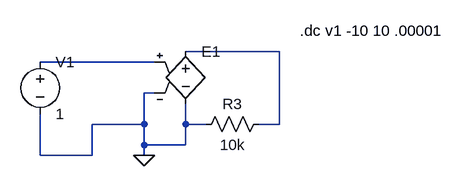
[diagram p0: schematic e_table.asc]
e_table.asc, the LTspice schematic file:
Version 4
SHEET 1 880 680
WIRE 320 112 176 112
WIRE 128 128 -48 128
WIRE 128 176 112 176
WIRE 112 224 112 176
WIRE 112 224 32 224
WIRE 176 224 176 192
WIRE 208 224 176 224
WIRE 320 224 320 112
WIRE 320 224 288 224
WIRE 112 256 112 224
WIRE 176 256 176 224
WIRE 176 256 112 256
WIRE -48 272 -48 208
WIRE 32 272 32 224
WIRE 32 272 -48 272
WIRE 112 272 112 256
FLAG 112 272 0
SYMBOL e 176 96 R0
WINDOW 3 24 96 Invisible 2
SYMATTR Value (-100,-12)(-.6u,-12)(.6u,12)(100,12)
SYMATTR InstName E1
SYMATTR SpiceModel table
SYMBOL res 304 208 R90
WINDOW 0 0 56 VBottom 2
WINDOW 3 32 56 VTop 2
SYMATTR InstName R3
SYMATTR Value 10k
SYMBOL voltage -48 112 R0
WINDOW 123 0 0 Left 2
WINDOW 39 0 0 Left 2
SYMATTR InstName V1
SYMATTR Value 1
TEXT 352 80 Left 2 !.dc v1 -10 10 .00001

The netlist it stands for:
* e_table.asc
E1 N001 0 N002 0 table (-100,-12)(-.6u,-12)(.6u,12)(100,12)
R3 N001 0 10k
V1 N002 0 1
.dc v1 -10 10 .00001
.backanno
.end